# Altium schematic sheet interface_com_usuario_comunicacao.SchDoc
size A4; SheetNumber: 3; SheetTotal: 4
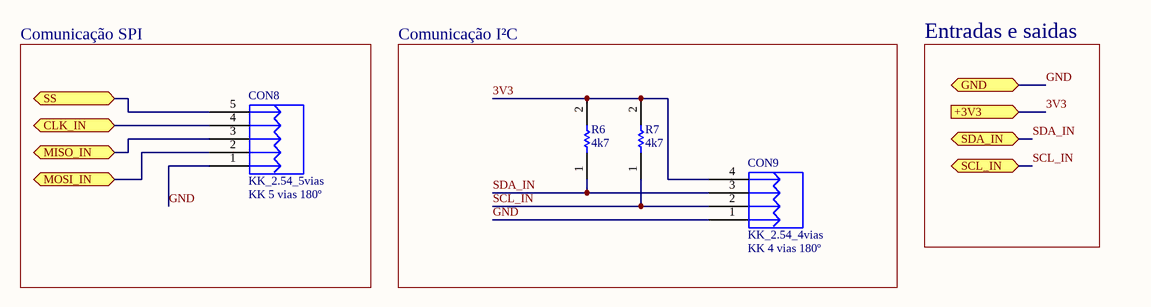
[diagram p0: interface_com_usuario_comunicacao.SchDoc]

## Parts
CON8  KK_2.54_5vias  Valor: KK 5 vias 180º  [KK_5vias_180°]
CON9  KK_2.54_4vias  Valor: KK 4 vias 180º  [KK_4vias_180°]
R6  4k7  [RESC3216X60N]
R7  4k7  [RESC3216X60N]

## Blocks framed on the sheet
Comunicação SPI: CON8
Comunicação I²C: CON9 R6 R7

## Ports
+3V3 (in), CLK_IN (bidir), GND (bidir), MISO_IN (bidir), MOSI_IN (bidir), SCL_IN (bidir), SDA_IN (bidir), SS (bidir)

## Nets
3V3: CON9.4 R6.2 R7.2 ; port +3V3
CLK_IN: CON8.4 ; port CLK_IN
GND: CON8.1 CON9.1 ; port GND
MISO_IN: CON8.3 ; port MISO_IN
MOSI_IN: CON8.2 ; port MOSI_IN
SCL_IN: CON9.2 R7.1 ; port SCL_IN
SDA_IN: CON9.3 R6.1 ; port SDA_IN
SS: CON8.5 ; port SS

## Notes on the sheet
- Entradas e saidas

## Library data of the parts
CON8 = KK_2.54_5vias: Conector KK 2.54mm 5 vias; Descrição: Conector KK 3 vias com passo 2.54mm; Encapsulamento: PTH - 180º; Modelo: 3 vias - 180º; Marca: *; Observação: *
CON9 = KK_2.54_4vias: Conector KK 2.54mm 4 vias; Descrição: Conector KK 3 vias com passo 2.54mm; Encapsulamento: PTH - 180º; Modelo: 3 vias - 180º; Marca: *; Observação: *
R6 R7 = RES 1206: RES 1206 5%; Manufacturer_Name: Vishay; Manufacturer_Part_Number: CRCW12064K70FKEA; Datasheet Link: http://docs-emea.rs-online.com/webdocs/13ec/0900766b813ecc08.pdf; Height: 0.6mm; Mouser Part Number: 71-CRCW1206-4.7K-E3; Mouser Price/Stock: https://www.mouser.co.uk/ProductDetail/Vishay-Dale/CRCW12064K70FKEA?qs=1vm4qhDHCvlKJmatsKzyFQ%3D%3D; Arrow Part Number: CRCW12064K70FKEA; Arrow Price/Stock: https://www.arrow.com/en/products/crcw12064k70fkea/vishay